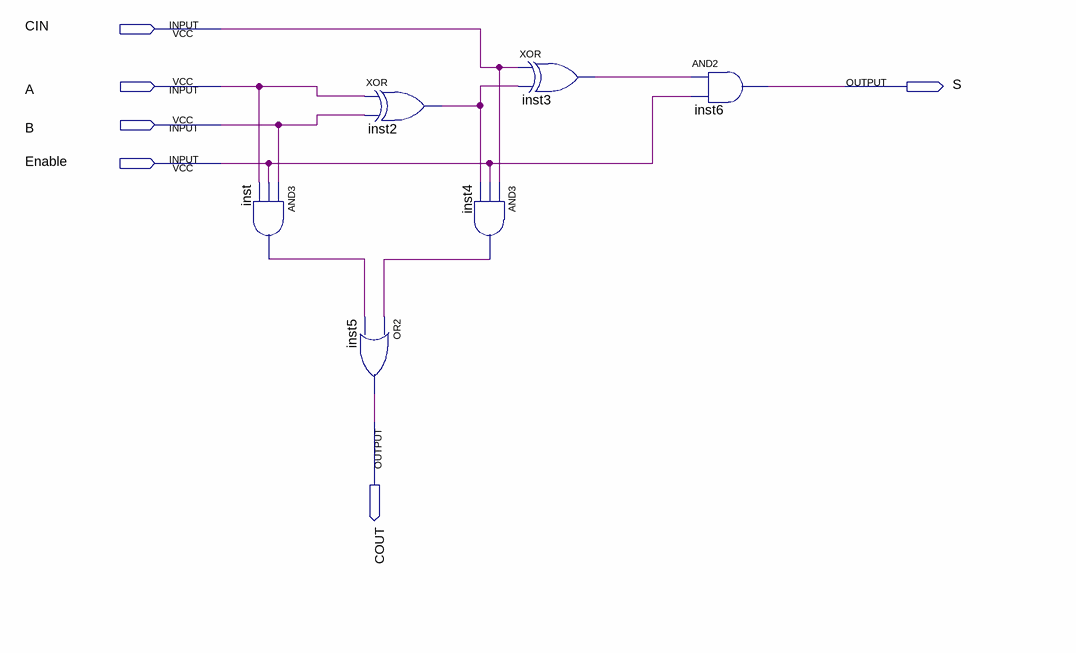
[diagram p0: schematic sheet]
// Quartus schematic FULL_ADDER_1bit.bdf as structural Verilog: 6 symbols, 6 pins
module FULL_ADDER_1bit (
  input  CIN,
  input  A,
  input  B,
  input  Enable,
  output S,
  output COUT
);

  wire inst2_out, inst3_out, inst4_out, inst_out;

  and inst (inst_out, B, Enable, A);
  xor inst2 (inst2_out, A, B);
  or inst5 (COUT, inst4_out, inst_out);
  xor inst3 (inst3_out, CIN, inst2_out);
  and inst4 (inst4_out, CIN, Enable, inst2_out);
  and inst6 (S, inst3_out, Enable);
endmodule
